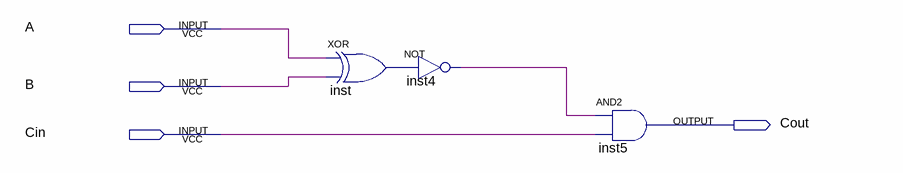
[diagram p0: schematic sheet]
// Quartus schematic IGUAL1-DIAGRAMA.bdf as structural Verilog: 3 symbols, 4 pins
module \IGUAL1-DIAGRAMA  (
  input  A,
  input  B,
  input  Cin,
  output Cout
);

  wire inst4_out, inst_out;

  xor inst (inst_out, A, B);
  not inst4 (inst4_out, inst_out);
  and inst5 (Cout, inst4_out, Cin);
endmodule
